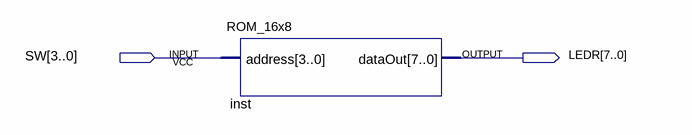
[diagram p0: schematic sheet]
// Quartus schematic ROM_Demo.bdf as structural Verilog: 1 symbols, 2 pins
module ROM_Demo (
  input  [3:0] SW,
  output [7:0] LEDR
);

  ROM_16x8 inst (.address(SW), .dataOut(LEDR));
endmodule
